# EAGLE design breakout (EAGLE 9.2.2)
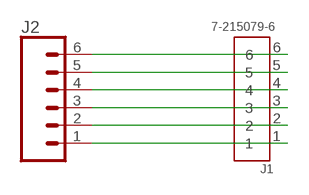
[diagram p0: schematic, sheet 1]

## Parts
J1  7-215079-6  [TE_7-215079-6]
J2  CONN_06LONGPADS  [1X06_LONGPADS]

## Nets
N$1: J1.6 J2.6
N$2: J1.5 J2.5
N$3: J1.4 J2.4
N$4: J1.3 J2.3
N$5: J1.2 J2.2
N$6: J1.1 J2.1

## Library data of the parts
J1 = 7-215079-6:7-215079-6: Conn FFC Connector F 6 POS 1.27mm Solder ST Thru-Hole Automotive Box; AVAILABILITY: Unavailable; COMMENT: 7-215079-6; DESCRIPTION: Conn FFC Connector F 6 POS 1.27mm Solder ST Thru-Hole Automotive Box; MF: TE Connectivity; MP: 7-215079-6; PACKAGE: None; PRICE: None; TE_PURCHASE_URL: https://www.te.com/usa-en/product-7-215079-6.html?te_bu=Cor&te_type=disp&te_campaign=seda_glo_cor-seda-global-disp-prtnr-fy19-seda-model-bom-cta_sma-317_1&elqCampaignId=32493
J2 = SparkFun-Connectors:CONN_06: Multi connection point. Often used as Generic Header-pin footprint for 0.1 inch spaced/style header connections On any of the 0.1 inch spaced packages, you can populate with these: Break Away Headers - Straight <https://www.sparkfun.com/products/116> (PRT-00116) Break Away Male Headers - Right Angle <https://www.sparkfun.com/products/553> (PRT-00553) Female Headers <https://www.sparkfun.com/products/115> (PRT-00115) Break Away Headers - Machine Pin <https://www.sparkfun.com/products/117> (PRT-00117) Break Away Female Headers - Swiss Machine Pin <https://www.sparkfun.com/products/743> (PRT-00743) Arduino Stackable Header - 6 Pin <https://www.sparkfun.com/products/9280> (PRT-09280) For SCREWTERMINALS and SPRING TERMINALS visit here: Screw Terimnals on SparkFun.com <https://www.sparkfun.com/search/results?term=Screw+Terminals> (5mm/3.5mm/2.54mm spacing) This device is also useful as a general connection point to wire up your design to another part of your project. Our various solder wires solder well into these plated through hole pads. Hook-Up Wire - Assortment (Stranded, 22 AWG) <https://www.sparkfun.com/products/11375> (PRT-11375) Hook-Up Wire - Assortment (Solid Core, 22 AWG) <https://www.sparkfun.com/products/11367> (PRT-11367) View the entire wire category on our website here <https://www.sparkfun.com/categories/141>

## Board
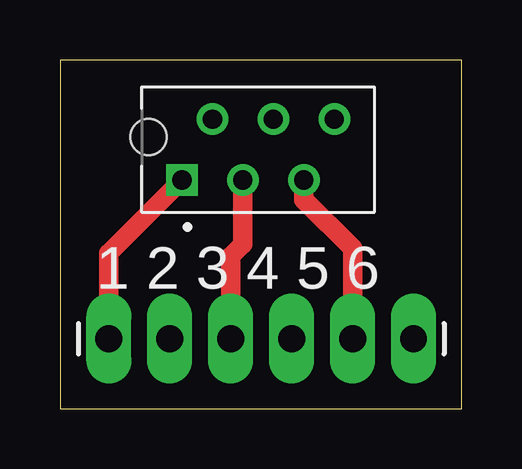
[diagram p1: board, top side]
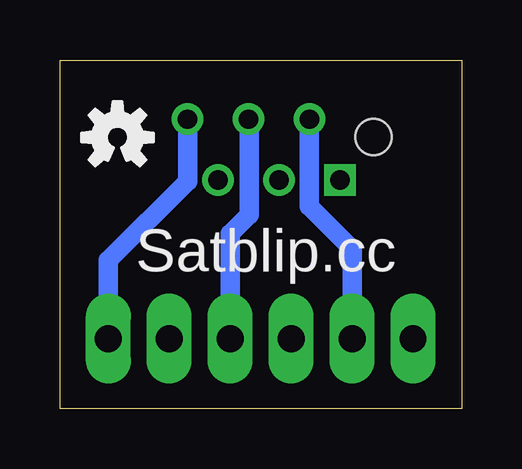
[diagram p2: board, bottom side, seen from below]

Size 16.74 x 14.53 mm. Coordinates in mm from the lower left corner, seen from the top.
Outline: 0,0 16.74,0 16.74,14.53 0,14.53 0,0
Copper layers (1*16): Top 0.035mm / dielectric 1.5mm / Bottom 0.035mm
Design rules "default": minimum track width 6mil, minimum drill 0.35mm, track to track 6mil, track to pad 6mil, pad to pad 6mil, via to via 6mil, smd to smd 6mil, copper to edge 40mil, drill to drill 6mil, minimum pad ring 10mil, minimum via ring 8mil, stop-mask expansion 4mil, vias tented up to drill 0mil, thermal gap 10mil

### Footprints (pad centres in the part's own frame; a part is rotated, then mirrored left to right if it is on the bottom)
TE_7-215079-6 = drill 0.8 square: 1 3.175,1.27 | drill 0.8: 2 1.905,-1.27; 3 0.635,1.27; 4 -0.635,-1.27; 5 -1.905,1.27; 6 -3.175,-1.27 | hole 1.5: 4.575,-0.53
1X06_LONGPADS = drill 1.118 pad 1.88 long: 1 0,0; 2 2.54,0; 3 5.08,0; 4 7.62,0; 5 10.16,0; 6 12.7,0

### Placement (x,y rotation side)
J1  8.26,10.79 180 top
J2  2.03,2.92 0 top
U$1  [OSHW-LOGO-S]  14.35,11.3 0 bottom

### Tracks (layer width: path | path; a pad name or v marks a point on that pad's centre or on a via)
N$1
  Bottom 0.813: J1.6 11.43,9.48 14.73,6.18 J2.6
N$2
  Top 0.813: J1.5 10.16,8.71 12.19,6.68 J2.5
N$3
  Bottom 0.813: J1.4 8.86,12.03 8.86,8.09 9.65,7.29 J2.4
N$4
  Top 0.813: J1.3 7.62,6.86 7.11,6.35 J2.3
N$5
  Bottom 0.813: J2.2 4.57,6.64 6.36,8.43 6.36,12.05 J1.2
N$6
  Top 0.813: J1.1 2.03,6.48 J2.1

### Text on the board
tNames: 1 2 3 4 5 6
bNames: Satblip.cc